# EAGLE design ultra-violet-tooth-sensor-mk-1.0 (EAGLE 6.5.0)
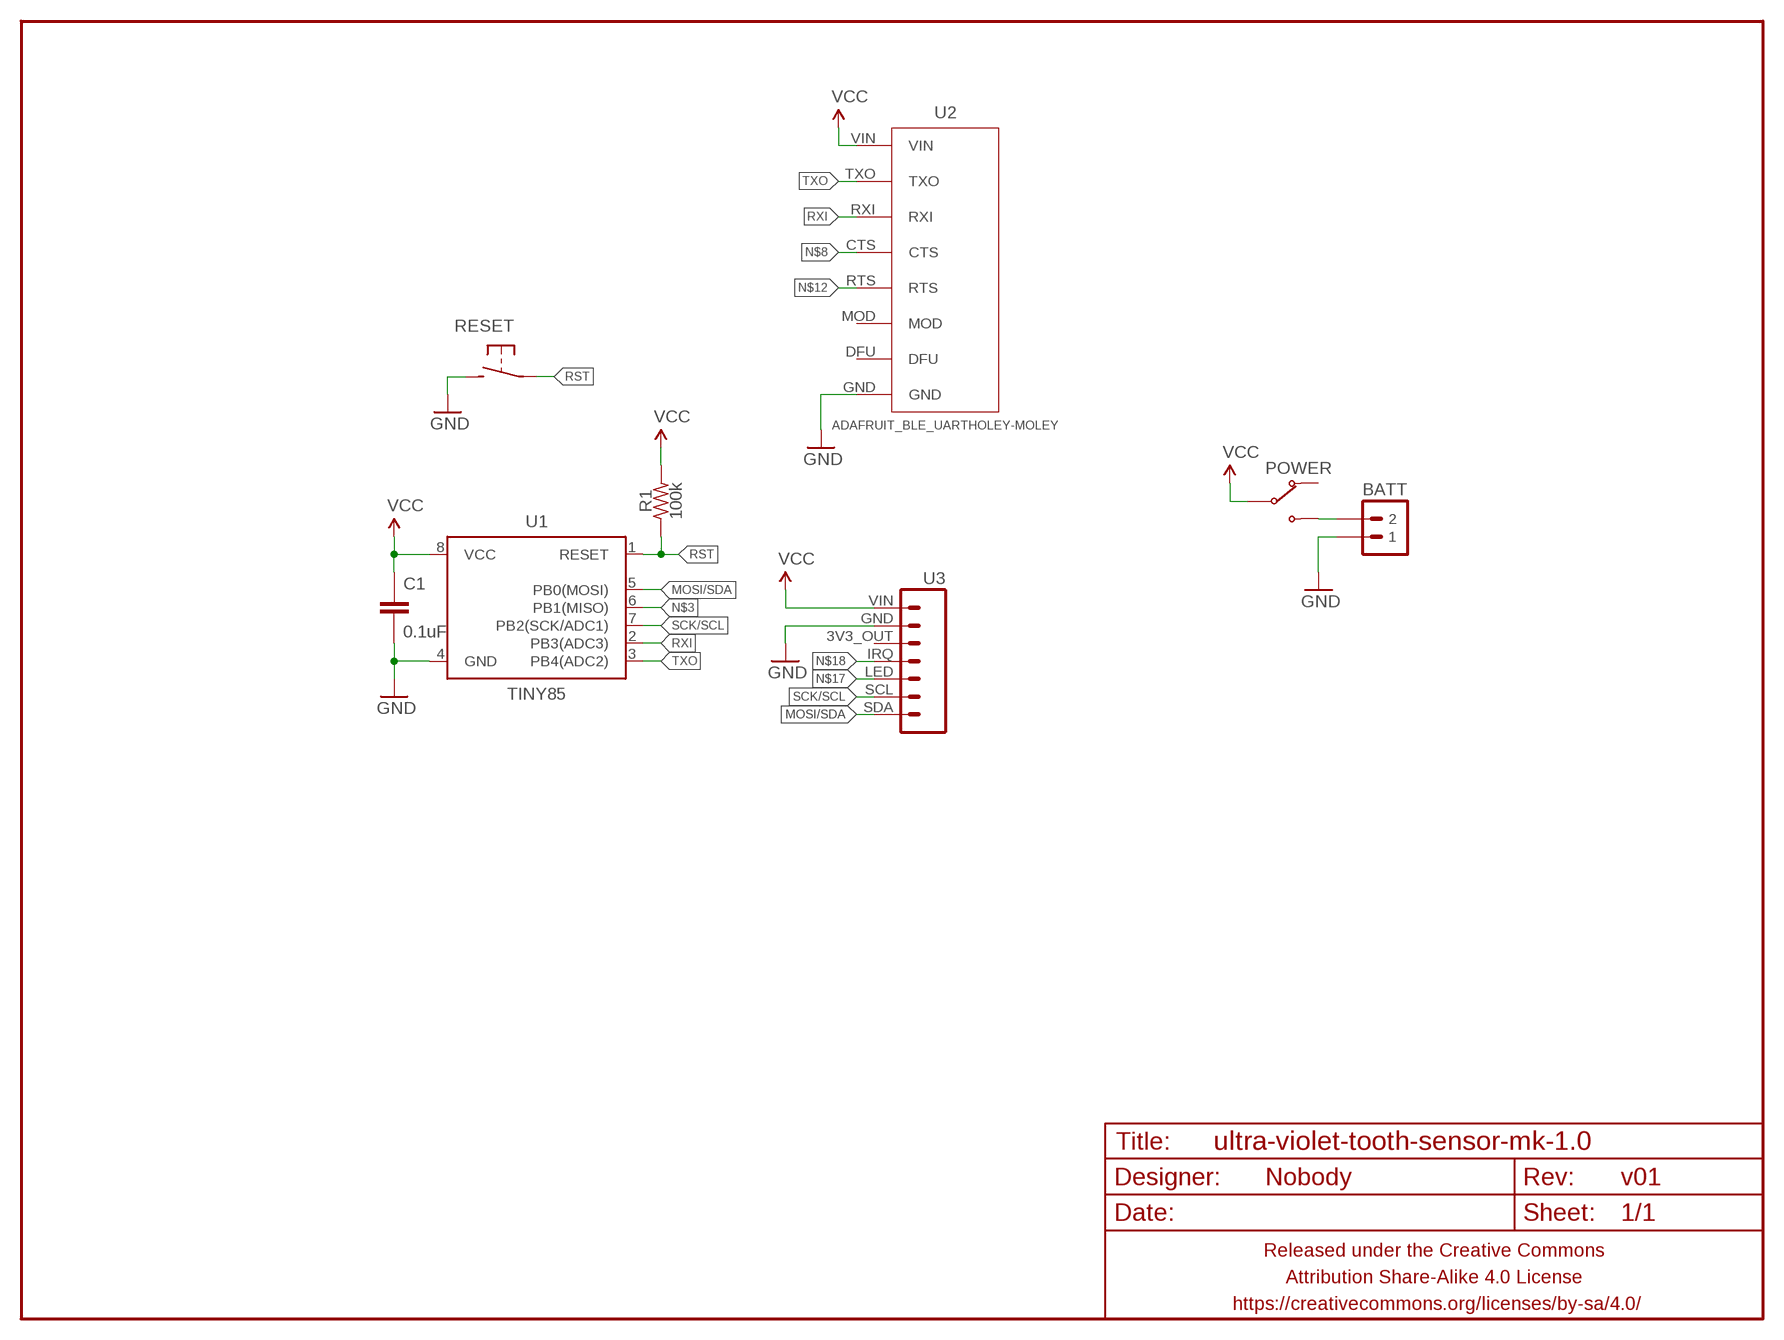
[diagram p0: schematic, sheet 1]

## Parts
BATT  M02PTH-CENTERED-R+  [1X02-CENTER-R+]
C1  0.1uF  CAPACITOR-CERAMIC025-024X044  [C025-024X044]
FRAME1  FRAME-LETTERNO_PACKAGE  [DUMMY]
POWER  SWITCH-SPDTPTH-RA-2.54MM  [SPDT-RA-2.54MM]
R1  100k  RESISTORPTH-AXIAL-7.62MM  [RESISTOR-AXIAL-PTH-7.62MM]
RESET  SPST-NO-TACT3MM-RA  [TACTILE-PTH-SIDE]
U1  TINY85  ATTINY45TINY85-20-DIP  [DIP08]
U2  ADAFRUIT_BLE_UARTHOLEY-MOLEY  [ADAFRUIT_BLE_UART_HOLEY]
U3  ADAFRUIT-SI1145-BREAKOUT  [ADAFRUIT-SI1145-BREAKOUT]

## Nets
GND: BATT.1 C1.2 RESET.2 U1.4(GND) U2.GND U3.GND
MOSI/SDA: U1.5(PB0(MOSI)) U3.SDA
N$1: BATT.2 POWER.3(NO)
N$3: U1.6(PB1(MISO))
N$8: U2.CTS
N$12: U2.RTS
N$17: U3.LED
N$18: U3.IRQ
RST: R1.P$1 RESET.1 U1.1(RESET)
RXI: U1.2(PB3(ADC3)) U2.RXI
SCK/SCL: U1.7(PB2(SCK/ADC1)) U3.SCL
TXO: U1.3(PB4(ADC2)) U2.TXO
VCC: C1.1 POWER.2(COM) R1.P$2 U1.8(VCC) U2.VIN U3.VIN
Unconnected: POWER.1(NC) U2.DFU U2.MOD U3.3V3_OUT

## Library data of the parts
BATT = A_butts:M02: Standard 2-pin 0.1" header. Use with - straight break away headers ( PRT-00116) - right angle break away headers (PRT-00553) - swiss pins (PRT-00743) - machine pins (PRT-00117) - female headers (PRT-00115) Molex polarized connector foot print use with: PRT-08233 with associated crimp pins and housings. 2.54_SCREWTERM for use with PRT-10571. 3.5mm Screw Terminal footprints for PRT-08084 5mm Screw Terminal footprints for use with PRT-08433
C1 = A_butts:CAPACITOR-CERAMIC: CAPACITOR, European symbol
FRAME1 = A_butts:FRAME-LETTER: Schematic Frame Standard 8.5x11 US Letter frame; DESIGNER: Nobody; VERSION: v01
POWER = A_butts:SWITCH-SPDT
R1 = A_butts:RESISTOR: RESISTOR, American symbol
RESET = A_butts:SPST-NO-TACT
U1 = A_butts:ATTINY45: Atmel 8-pin 2/4/8kB flash uC; PROD_ID: IC-09445; VALUE: TINY85-20-DIP
U2 = A_butts:ADAFRUIT_BLE_UART
U3 = A_butts:ADAFRUIT-SI1145-BREAKOUT

## Board
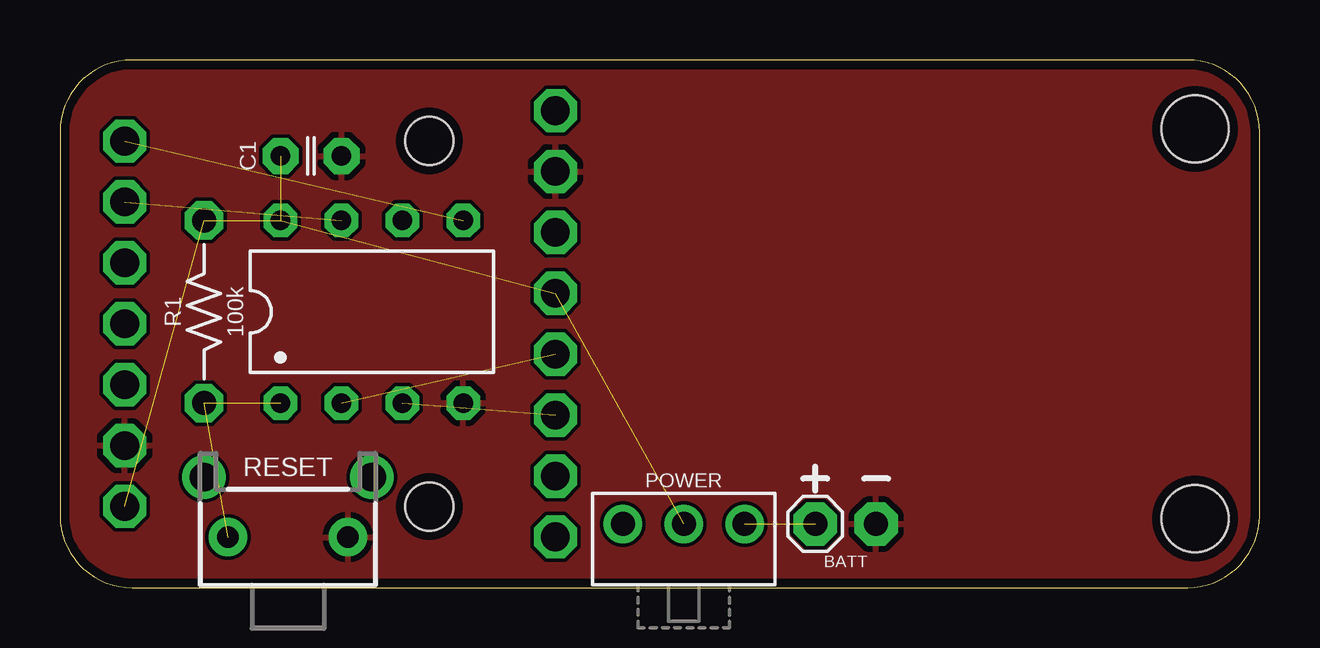
[diagram p1: board, top side]
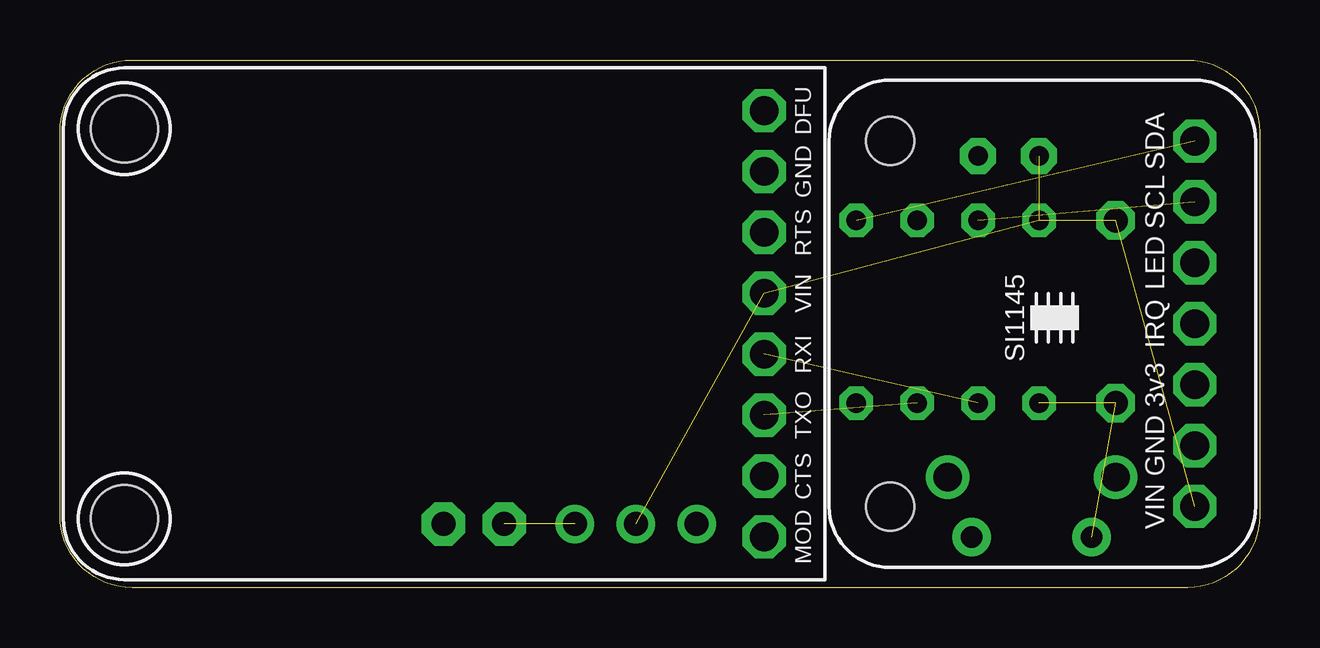
[diagram p2: board, bottom side, seen from below]

Size 50 x 22 mm. Coordinates in mm from the lower left corner, seen from the top.
Outline: 0,19 0,3 arc90 3,0 47,0 arc90 50,3 50,19 arc90 47,22 3,22 arc90 0,19
Copper layers (1*16): Top 0.0356mm / dielectric 1.5011mm / Bottom 0.0356mm
Design rules "LaenPCBOrder_2": minimum track width 6mil, minimum drill 13mil, track to track 6mil, track to pad 6mil, pad to pad 6mil, via to via 6mil, smd to smd 6mil, copper to edge 15mil, drill to drill 6mil, minimum pad ring 7mil, minimum via ring 7mil, stop-mask expansion 3mil, vias tented up to drill 20mil, thermal gap 10mil

### Footprints (pad centres in the part's own frame; a part is rotated, then mirrored left to right if it is on the bottom)
1X02-CENTER-R+ = drill 1 pad 1.8 octagon: 1 -1.27,0; 2 1.27,0
C025-024X044 = drill 0.813 pad 1.5 octagon: 1 -1.27,0; 2 1.27,0
SPDT-RA-2.54MM = drill 1 pad 1.6: 1 0,0; 2 2.54,0; 3 5.08,0
RESISTOR-AXIAL-PTH-7.62MM = drill 1 pad 1.6 octagon: P$1 -3.81,0; P$2 3.81,0
TACTILE-PTH-SIDE = drill 0.9 pad 1.6: 1 -2.5,0; 2 2.5,0 | drill 1.2: ANCHOR1 -3.5,2.5; ANCHOR2 3.5,2.5
DIP08 = drill 0.8 pad 1.4 octagon: 1 -3.81,-3.81; 2 -1.27,-3.81; 3 1.27,-3.81; 4 3.81,-3.81; 5 3.81,3.81; 6 1.27,3.81; 7 -1.27,3.81; 8 -3.81,3.81
ADAFRUIT_BLE_UART_HOLEY = drill 1.2 pad 1.8 octagon: CTS -6.35,0; DFU 8.89,0; GND 6.35,0; MOD -8.89,0; RTS 3.81,0; RXI -1.27,0; TXO -3.81,0; VIN 1.27,0 | hole 2.8: -8.128,26.67; 8.128,26.67
ADAFRUIT-SI1145-BREAKOUT = drill 1.2 pad 1.8 octagon: 3V3_OUT -2.54,-6.35; GND -5.08,-6.35; IRQ 0,-6.35; LED 2.54,-6.35; SCL 5.08,-6.35; SDA 7.62,-6.35; VIN -7.62,-6.35 | hole 2: -7.62,6.35; 7.62,6.35

### Placement (x,y rotation side)
BATT  32.75,2.65 180 top
C1  10.46,18 0 top
FRAME1  0,0 0 top
POWER  23.46,2.65 0 top
R1  6,11.5 90 top
RESET  9.5,2.1 0 top
U1  13,11.5 0 top
U2  20.65,11 90 bottom
U3  9.05,11 90 bottom

### Tracks (layer width: path | path; a pad name or v marks a point on that pad's centre or on a via)
GND
  pour Top: -0.1,-0.1 -0.1,22.1 50.1,22.1 50.1,-0.1
MOSI/SDA  (1 unrouted)
N$1  (1 unrouted)
RST  (2 unrouted)
RXI  (1 unrouted)
SCK/SCL  (1 unrouted)
TXO  (1 unrouted)
VCC  (5 unrouted)